# EAGLE schematic nexus_uart (EAGLE 7.3.0)
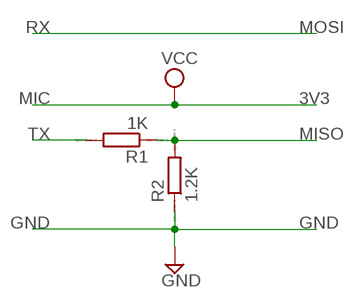
[diagram p0: schematic, sheet 1]

## Parts
R1  1K  R0204/7  [0204/7]
R2  1.2K  R0204/7  [0204/7]

## Nets
GND: R2.1
N$2: R1.2
RX: R1.1 R2.2

## Notes on the sheet
- RX | MOSI
- MIC | 3V3
- TX | MISO
- GND | GND

## Library data of the parts
R1 R2 = eagle-ltspice:R: RESISTOR, European symbol; SPICEMODEL: NONE; SPICEPREFIX: R